# Altium schematic sheet Comms.SchDoc: Comms Board Comms
size A3; DrawnBy: Scott Camp and Finn Molloy; Address1: ECE Department; Address2: University of Canterbury; Address3: Christchurch 8041; Address4: New Zealand; Revision: 1
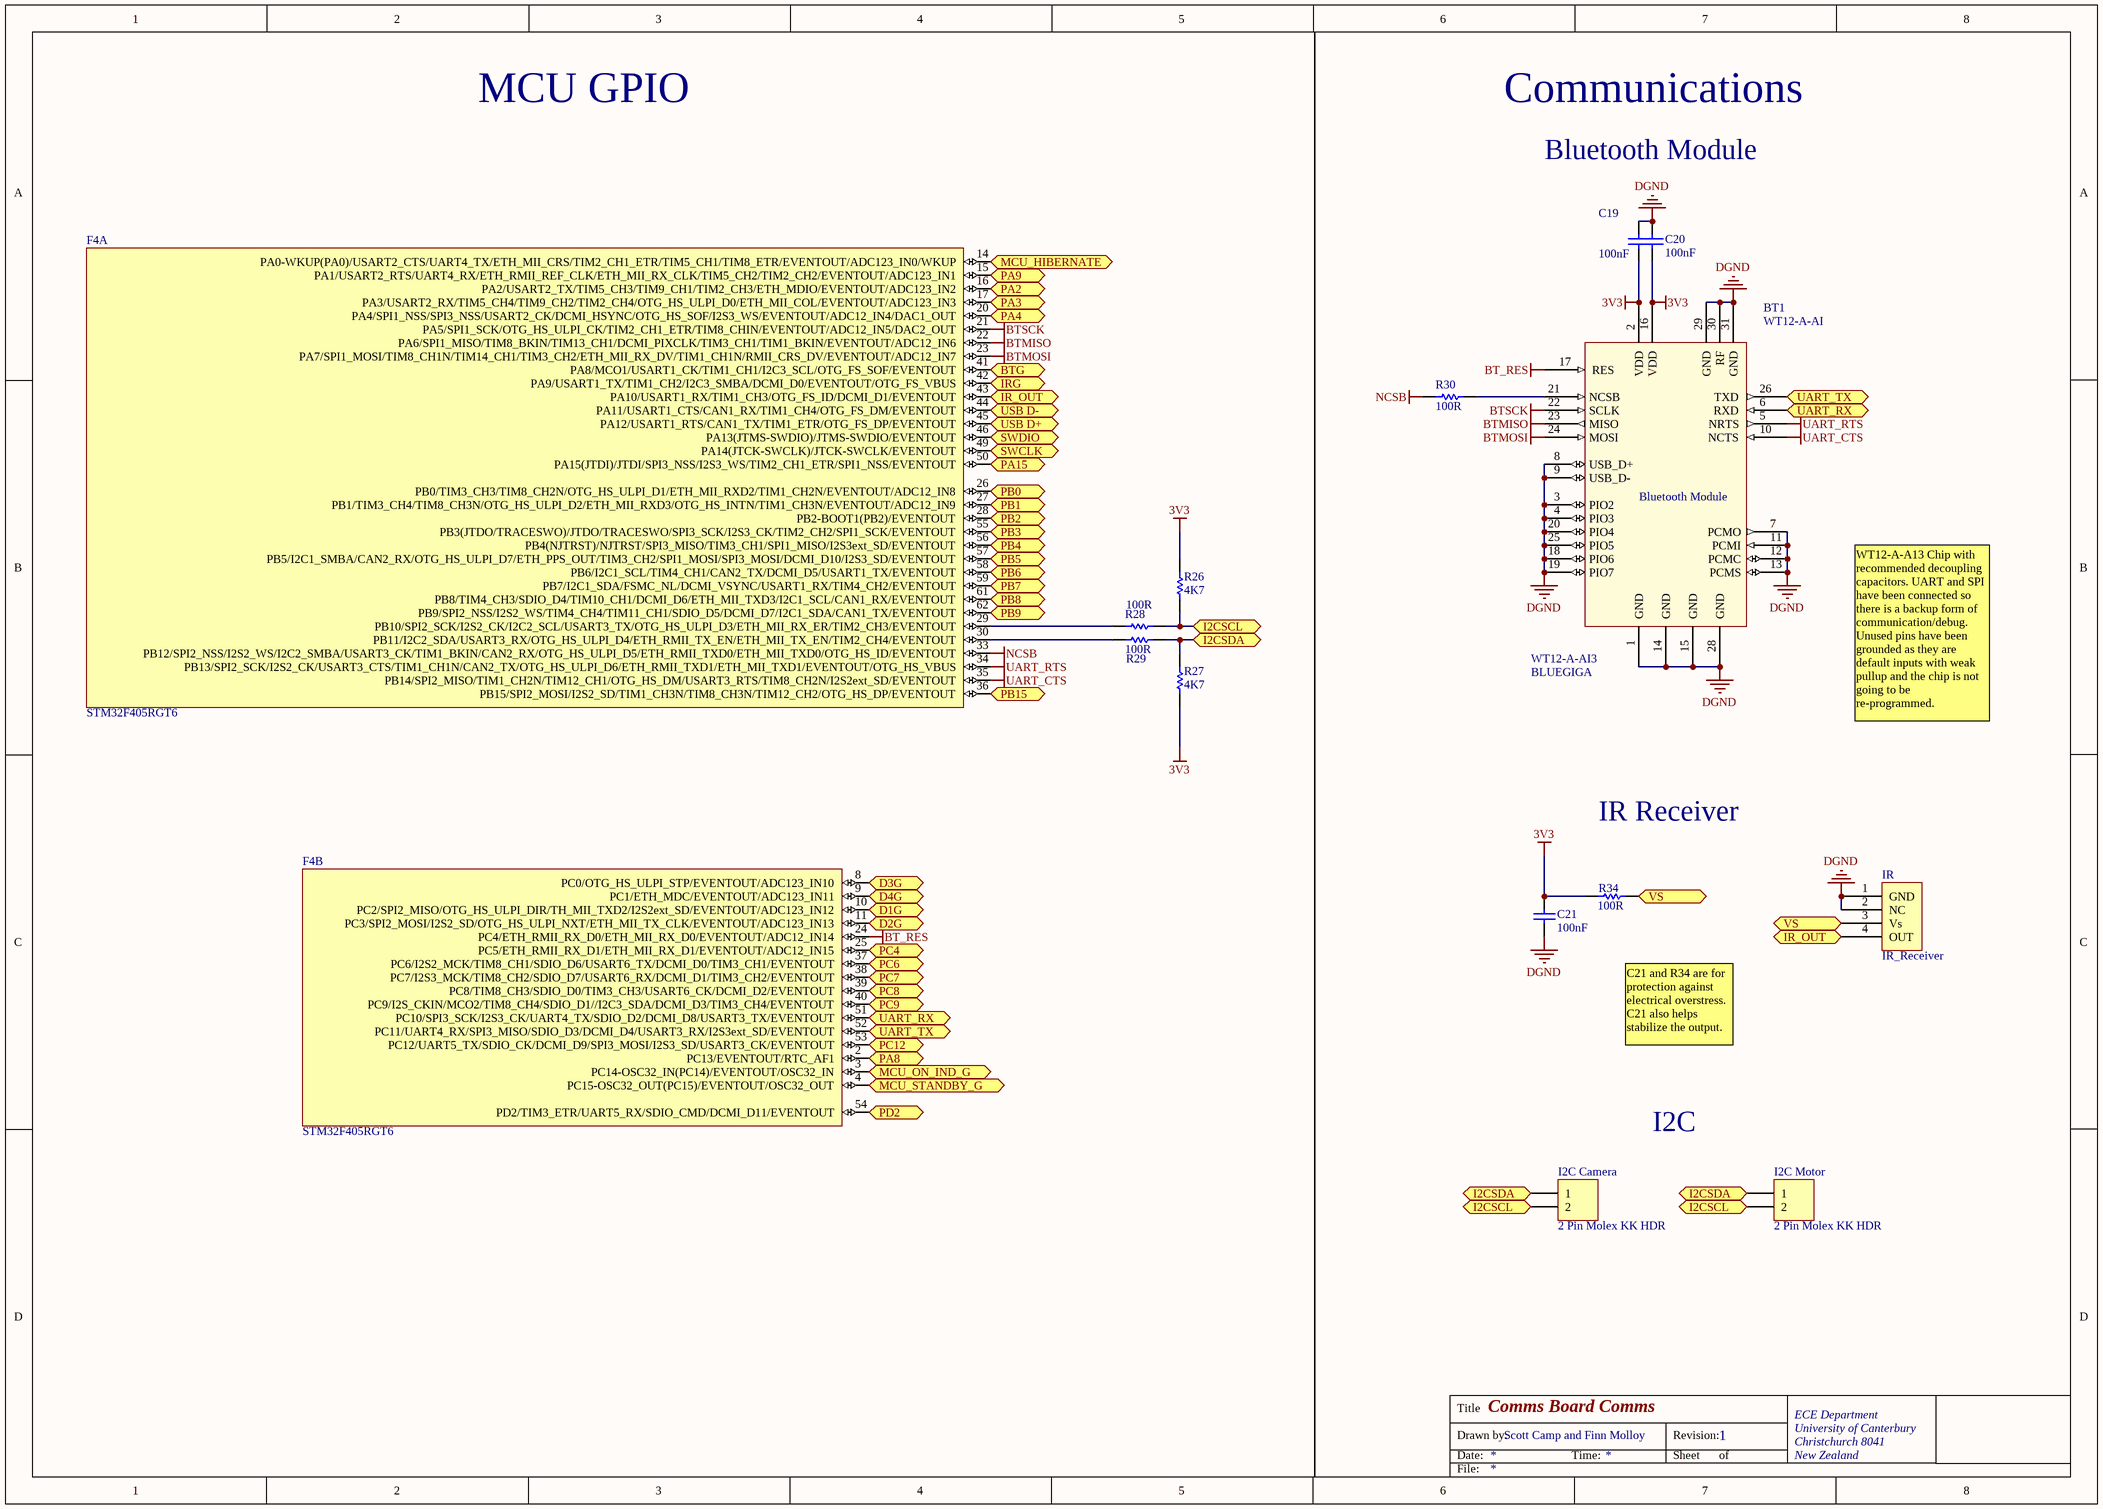
[diagram p0: Comms.SchDoc]

## Parts
BT1  Manufacturer: BLUEGIGA  Part Number: WT12-A-AI3  [WT12_Bluetooth]  (hidden comment: WT12-A-AI)
C19  100nF  [CAPC1005L]
C20  100nF  [CAPC1005L]
C21  100nF  [CAPC1005L]
F4  STM32F405RGT6  [TQFP64_V]  (parts A,B of 4)
I2C_Camera  2 Pin Molex KK HDR  [MOLEX_KK_2_HDR]
I2C_Motor  2 Pin Molex KK HDR  [MOLEX_KK_2_HDR]
IR  IR_Receiver  [IR]
R26  4K7  [RESC1608L]
R27  4K7  [RESC1608L]
R28  100R  [RESC1608L]
R29  100R  [RESC1608L]
R30  100R  [RESC1608L]
R34  100R  [RESC1608L]

## Ports
BTG (bidir), D1G (bidir), D2G (bidir), D3G (bidir), D4G (bidir), I2CSCL (bidir), I2CSDA (bidir), IR_OUT (bidir), IRG (bidir), MCU_HIBERNATE (bidir), MCU_ON_IND_G (bidir), MCU_STANDBY_G (bidir), PA2 (bidir), PA3 (bidir), PA4 (bidir), PA8 (bidir), PA9 (bidir), PA15 (bidir), PB0 (bidir), PB1 (bidir), PB2 (bidir), PB3 (bidir), PB4 (bidir), PB5 (bidir), PB6 (bidir), PB7 (bidir), PB8 (bidir), PB9 (bidir), PB15 (bidir), PC4 (bidir), PC6 (bidir), PC7 (bidir), PC8 (bidir), PC9 (bidir), PC12 (bidir), PD2 (bidir), SWCLK (bidir), SWDIO (bidir), UART_RX (bidir), UART_TX (bidir), USB D+ (bidir), USB D- (bidir), VS (bidir)

## Nets
3V3: BT1.2(VDD) BT1.16(VDD) C19.1 C20.1 C21.2 R26.2 R27.1 R34.1
BT_RES: BT1.17(RES) F4.24(PC4/ETH_RMII_RX_D0/ETH_MII_RX_D0/EVENTOUT/ADC12_IN14)
BTMISO: BT1.23(MISO) F4.22(PA6/SPI1_MISO/TIM8_BKIN/TIM13_CH1/DCMI_PIXCLK/TIM3_CH1/TIM1_BKIN/EVENTOUT/ADC12_IN6)
BTMOSI: BT1.24(MOSI) F4.23(PA7/SPI1_MOSI/TIM8_CH1N/TIM14_CH1/TIM3_CH2/ETH_MII_RX_DV/TIM1_CH1N/RMII_CRS_DV/EVENTOUT/ADC12_IN7)
BTSCK: BT1.22(SCLK) F4.21(PA5/SPI1_SCK/OTG_HS_ULPI_CK/TIM2_CH1_ETR/TIM8_CHIN/EVENTOUT/ADC12_IN5/DAC2_OUT)
DGND: BT1.1(GND) BT1.3(PIO2) BT1.4(PIO3) BT1.7(PCMO) BT1.8(USB_D+) BT1.9(USB_D-) BT1.11(PCMI) BT1.12(PCMC) BT1.13(PCMS) BT1.14(GND) BT1.15(GND) BT1.18(PIO6) BT1.19(PIO7) BT1.20(PIO4) BT1.25(PIO5) BT1.28(GND) BT1.29(GND) BT1.30(RF) BT1.31(GND) C19.2 C20.2 C21.1 IR.1(GND) IR.2(NC)
NCSB: F4.33(PB12/SPI2_NSS/I2S2_WS/I2C2_SMBA/USART3_CK/TIM1_BKIN/CAN2_RX/OTG_HS_ULPI_D5/ETH_RMII_TXD0/ETH_MII_TXD0/OTG_HS_ID/EVENTOUT) R30.1
UART_CTS: BT1.10(NCTS) F4.35(PB14/SPI2_MISO/TIM1_CH2N/TIM12_CH1/OTG_HS_DM/USART3_RTS/TIM8_CH2N/I2S2ext_SD/EVENTOUT)
UART_RTS: BT1.5(NRTS) F4.34(PB13/SPI2_SCK/I2S2_CK/USART3_CTS/TIM1_CH1N/CAN2_TX/OTG_HS_ULPI_D6/ETH_RMII_TXD1/ETH_MII_TXD1/EVENTOUT/OTG_HS_VBUS)
BTG: F4.41(PA8/MCO1/USART1_CK/TIM1_CH1/I2C3_SCL/OTG_FS_SOF/EVENTOUT) ; port BTG
D1G: F4.10(PC2/SPI2_MISO/OTG_HS_ULPI_DIR/TH_MII_TXD2/I2S2ext_SD/EVENTOUT/ADC123_IN12) ; port D1G
D2G: F4.11(PC3/SPI2_MOSI/I2S2_SD/OTG_HS_ULPI_NXT/ETH_MII_TX_CLK/EVENTOUT/ADC123_IN13) ; port D2G
D3G: F4.8(PC0/OTG_HS_ULPI_STP/EVENTOUT/ADC123_IN10) ; port D3G
D4G: F4.9(PC1/ETH_MDC/EVENTOUT/ADC123_IN11) ; port D4G
I2CSCL: I2C_Camera.2 I2C_Motor.2 R26.1 R28.2 ; port I2CSCL
I2CSDA: I2C_Camera.1 I2C_Motor.1 R27.2 R29.2 ; port I2CSDA
IR_OUT: F4.43(PA10/USART1_RX/TIM1_CH3/OTG_FS_ID/DCMI_D1/EVENTOUT) IR.4(OUT) ; port IR_OUT
IRG: F4.42(PA9/USART1_TX/TIM1_CH2/I2C3_SMBA/DCMI_D0/EVENTOUT/OTG_FS_VBUS) ; port IRG
MCU_HIBERNATE: F4.14(PA0-WKUP(PA0)/USART2_CTS/UART4_TX/ETH_MII_CRS/TIM2_CH1_ETR/TIM5_CH1/TIM8_ETR/EVENTOUT/ADC123_IN0/WKUP) ; port MCU_HIBERNATE
MCU_ON_IND_G: F4.3(PC14-OSC32_IN(PC14)/EVENTOUT/OSC32_IN) ; port MCU_ON_IND_G
MCU_STANDBY_G: F4.4(PC15-OSC32_OUT(PC15)/EVENTOUT/OSC32_OUT) ; port MCU_STANDBY_G
PA2: F4.16(PA2/USART2_TX/TIM5_CH3/TIM9_CH1/TIM2_CH3/ETH_MDIO/EVENTOUT/ADC123_IN2) ; port PA2
PA3: F4.17(PA3/USART2_RX/TIM5_CH4/TIM9_CH2/TIM2_CH4/OTG_HS_ULPI_D0/ETH_MII_COL/EVENTOUT/ADC123_IN3) ; port PA3
PA4: F4.20(PA4/SPI1_NSS/SPI3_NSS/USART2_CK/DCMI_HSYNC/OTG_HS_SOF/I2S3_WS/EVENTOUT/ADC12_IN4/DAC1_OUT) ; port PA4
PA8: F4.2(PC13/EVENTOUT/RTC_AF1) ; port PA8
PA9: F4.15(PA1/USART2_RTS/UART4_RX/ETH_RMII_REF_CLK/ETH_MII_RX_CLK/TIM5_CH2/TIM2_CH2/EVENTOUT/ADC123_IN1) ; port PA9
PA15: F4.50(PA15(JTDI)/JTDI/SPI3_NSS/I2S3_WS/TIM2_CH1_ETR/SPI1_NSS/EVENTOUT) ; port PA15
PB0: F4.26(PB0/TIM3_CH3/TIM8_CH2N/OTG_HS_ULPI_D1/ETH_MII_RXD2/TIM1_CH2N/EVENTOUT/ADC12_IN8) ; port PB0
PB1: F4.27(PB1/TIM3_CH4/TIM8_CH3N/OTG_HS_ULPI_D2/ETH_MII_RXD3/OTG_HS_INTN/TIM1_CH3N/EVENTOUT/ADC12_IN9) ; port PB1
PB2: F4.28(PB2-BOOT1(PB2)/EVENTOUT) ; port PB2
PB3: F4.55(PB3(JTDO/TRACESWO)/JTDO/TRACESWO/SPI3_SCK/I2S3_CK/TIM2_CH2/SPI1_SCK/EVENTOUT) ; port PB3
PB4: F4.56(PB4(NJTRST)/NJTRST/SPI3_MISO/TIM3_CH1/SPI1_MISO/I2S3ext_SD/EVENTOUT) ; port PB4
PB5: F4.57(PB5/I2C1_SMBA/CAN2_RX/OTG_HS_ULPI_D7/ETH_PPS_OUT/TIM3_CH2/SPI1_MOSI/SPI3_MOSI/DCMI_D10/I2S3_SD/EVENTOUT) ; port PB5
PB6: F4.58(PB6/I2C1_SCL/TIM4_CH1/CAN2_TX/DCMI_D5/USART1_TX/EVENTOUT) ; port PB6
PB7: F4.59(PB7/I2C1_SDA/FSMC_NL/DCMI_VSYNC/USART1_RX/TIM4_CH2/EVENTOUT) ; port PB7
PB8: F4.61(PB8/TIM4_CH3/SDIO_D4/TIM10_CH1/DCMI_D6/ETH_MII_TXD3/I2C1_SCL/CAN1_RX/EVENTOUT) ; port PB8
PB9: F4.62(PB9/SPI2_NSS/I2S2_WS/TIM4_CH4/TIM11_CH1/SDIO_D5/DCMI_D7/I2C1_SDA/CAN1_TX/EVENTOUT) ; port PB9
PB15: F4.36(PB15/SPI2_MOSI/I2S2_SD/TIM1_CH3N/TIM8_CH3N/TIM12_CH2/OTG_HS_DP/EVENTOUT) ; port PB15
PC4: F4.25(PC5/ETH_RMII_RX_D1/ETH_MII_RX_D1/EVENTOUT/ADC12_IN15) ; port PC4
PC6: F4.37(PC6/I2S2_MCK/TIM8_CH1/SDIO_D6/USART6_TX/DCMI_D0/TIM3_CH1/EVENTOUT) ; port PC6
PC7: F4.38(PC7/I2S3_MCK/TIM8_CH2/SDIO_D7/USART6_RX/DCMI_D1/TIM3_CH2/EVENTOUT) ; port PC7
PC8: F4.39(PC8/TIM8_CH3/SDIO_D0/TIM3_CH3/USART6_CK/DCMI_D2/EVENTOUT) ; port PC8
PC9: F4.40(PC9/I2S_CKIN/MCO2/TIM8_CH4/SDIO_D1//I2C3_SDA/DCMI_D3/TIM3_CH4/EVENTOUT) ; port PC9
PC12: F4.53(PC12/UART5_TX/SDIO_CK/DCMI_D9/SPI3_MOSI/I2S3_SD/USART3_CK/EVENTOUT) ; port PC12
PD2: F4.54(PD2/TIM3_ETR/UART5_RX/SDIO_CMD/DCMI_D11/EVENTOUT) ; port PD2
SWCLK: F4.49(PA14(JTCK-SWCLK)/JTCK-SWCLK/EVENTOUT) ; port SWCLK
SWDIO: F4.46(PA13(JTMS-SWDIO)/JTMS-SWDIO/EVENTOUT) ; port SWDIO
UART_RX: BT1.6(RXD) F4.51(PC10/SPI3_SCK/I2S3_CK/UART4_TX/SDIO_D2/DCMI_D8/USART3_TX/EVENTOUT) ; port UART_RX
UART_TX: BT1.26(TXD) F4.52(PC11/UART4_RX/SPI3_MISO/SDIO_D3/DCMI_D4/USART3_RX/I2S3ext_SD/EVENTOUT) ; port UART_TX
USB D+: F4.45(PA12/USART1_RTS/CAN1_TX/TIM1_ETR/OTG_FS_DP/EVENTOUT) ; port USB D+
USB D-: F4.44(PA11/USART1_CTS/CAN1_RX/TIM1_CH4/OTG_FS_DM/EVENTOUT) ; port USB D-
VS: IR.3(Vs) R34.2 ; port VS
NetBT1_21: BT1.21(NCSB) R30.2
NetF4_29: F4.29(PB10/SPI2_SCK/I2S2_CK/I2C2_SCL/USART3_TX/OTG_HS_ULPI_D3/ETH_MII_RX_ER/TIM2_CH3/EVENTOUT) R28.1
NetF4_30: F4.30(PB11/I2C2_SDA/USART3_RX/OTG_HS_ULPI_D4/ETH_RMII_TX_EN/ETH_MII_TX_EN/TIM2_CH4/EVENTOUT) R29.1

## Notes on the sheet
- MCU GPIO
- Communications
- Bluetooth Module
- WT12-A-A13 Chip with recommended decoupling capacitors. UART and SPI have been connected so there is a backup form of communication/debug. Unused pins have been grounded as they are default inputs with weak pullup and the chip is not going to be re-programmed.
- IR Receiver
- C21 and R34 are for protection against electrical overstress. C21 also helps stabilize the output.
- I2C
- Title
- Drawn by:
- Date:
- Time:
- Revision:
- Sheet
- of
- File:
- (in symbol UN_WT12_Bluetooth) Bluetooth Module

## Library data of the parts
BT1 = UN_WT12_Bluetooth: BLUEGIGA - WT12-A-AI - BLUETOOTH MOD, V2.1, CLASS 2, 3MBPS; Order multiple: 1; Physical Interfaces: UART, USB; Supply Voltage Range: 3.2V to 3.4; value: WT12; price: 71.61; Supplier_Name: Element 14; published: 15/02/2010; Supplier_Component_Code: 1656896; ComponentLink1URL: http://www.bluegiga.com/files/bluegiga/Pub%20files/WT12_Product_Brief_lores.pdf; ComponentLink1Description: http://www.bluegiga.com/files/bluegiga/Pub%20files/WT12_Product_Brief_lores.pdf; Pricing: 1=69.22, 2=66.04, 10=57.4 (NZD); Manufacturer Part Number: WT12-A-AI
C19-C21 = CC_100nF_0402: CAP CER 100nF X7R +-10% 16V 0402; PackageReference: 0402; Code_IPC: 1005 [0402]; Verify: *; Supplier: ECE Dept Stock; Storage Location: Pottle; Value: 100nF
F4 = STM32F405RGT6: ARM Cortex-M4 32b MCU+FPU, 210DMIP, 1024 kB Flash, 192+4 kB RAM, 51 I/Os, 64-pin LQFP, -40 to +85°C, Tray; Internal RAM: 192kB; Operating Frequency (Processor Speed): 168MHz; A/D Converter: 16x12-bit; D/A Converter: 2x12-bit; 16-bit Timers (IC/OC/PWM): 12x16-bit(24/24/30); 32-bit Timer (IC/OC/PWM): 2x32-bit (8/8/8); Other Timer Functions: 2xWDG, RTC, 24-bit down counter; Serial Interface: 3xSPI/2xI2S/2xI2C/3xUSART(IrDa, ISO7816)/3xUART/1xUSB OTG FS/HS, 2xCAN/ SDIO; DatasheetVersion: rev2, Jan-2012; PackageVersion: 2012; PackageReference: TQFP64; PackageDescription: 64-Pin Low Profile Quad Flat Package, 10x10 mm Body, 0.5 mm Pitch; ComponentLink1Description: Manufacturer URL; ComponentLink1URL: http://www.st.com/; ComponentLink2Description: STM32F405/7 Datasheet; ComponentLink2URL: http://www.st.com/internet/com/TECHNICAL_RESOURCES/TECHNICAL_LITERATURE/DATASHEET/DM00037051.pdf; ComponentLink3Description: STM32F4 Web Page; ComponentLink3URL: http://www.st.com/internet/mcu/subclass/1521.jsp
I2C_Camera I2C_Motor = JA_MOLEX_KK_2POS: CONN HEADER 2POS 2.54mm VERT_Thru Hole; Supplier 1: Farnell; Supplier Part Number 1: 1462926; Supplier 2: ECE Store; Value: 2 Pin Molex KK HDR
R26 R27 = RS_4K7: RES 4.7K OHM 1/10W 5% 0603 SMD; Storage Location: ProtoPlace; Supplier: ECE Dept Stock; Value: 4K7
R28-R30 R34 = RS_100R: RES 100 OHM 1/10W 5% 0603 SMD; Storage Location: ProtoPlace; Supplier: ECE Dept Stock; Value: 100R